# EAGLE design Remote (EAGLE 8.4.1)
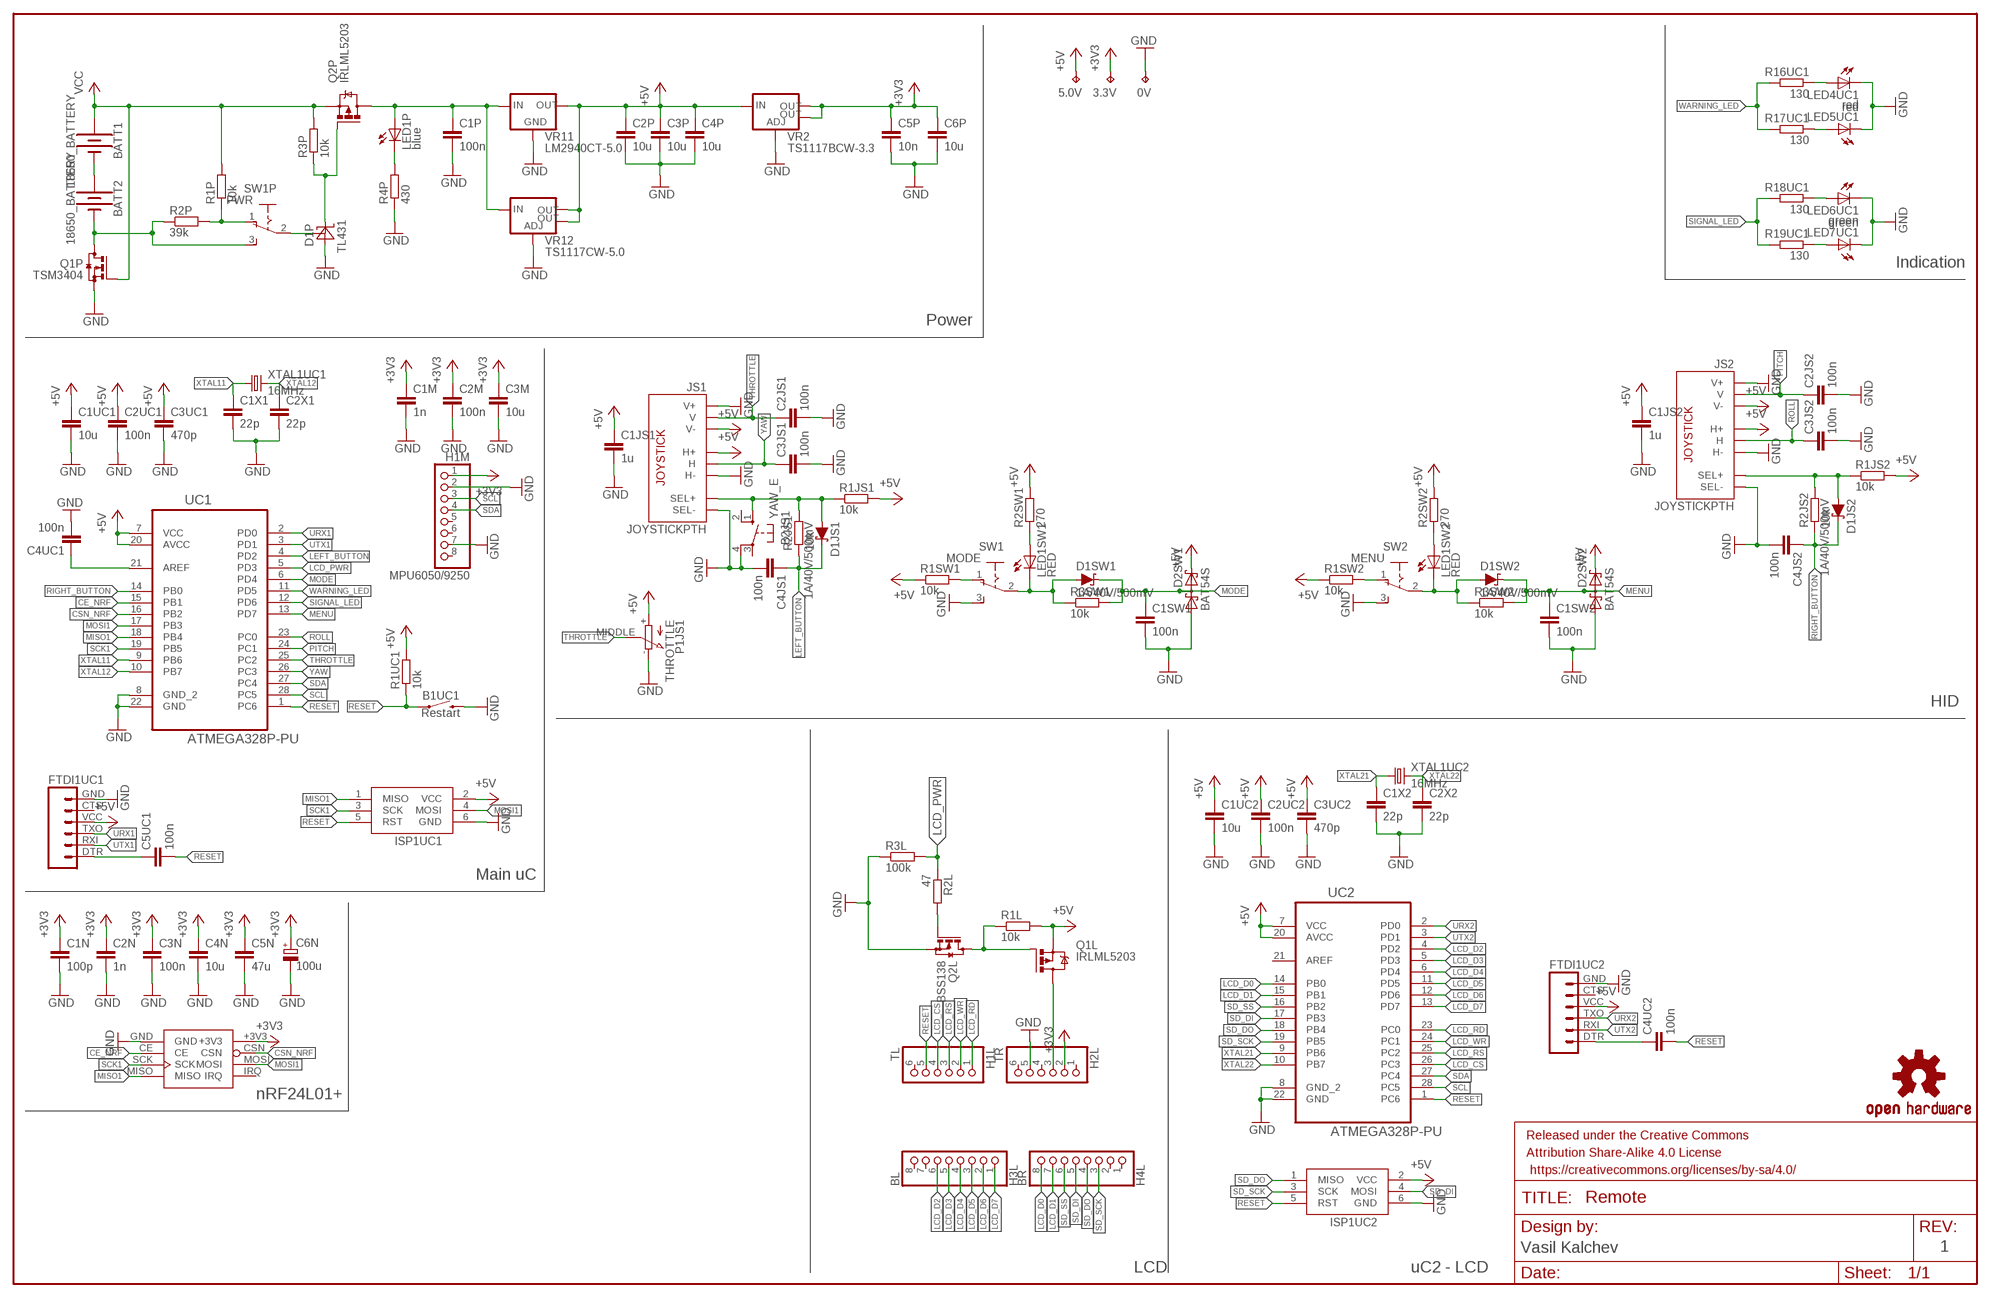
[diagram p0: schematic, sheet 1]

## Parts
0V  TPTP10SQ  [TP10SQ]
3.3V  TPTP10SQ  [TP10SQ]
5.0V  TPTP10SQ  [TP10SQ]
B1  nRF24L01+  NRF24L01+_PA_LNA_BREAKOUT  [NRF24L01+_PA_LNA]
B1UC1  Restart  MOMENTARY-SWITCH-SPST-SMD-6.0X3.5MM  [TACTILE_SWITCH_SMD_6.0X3.5MM]
B2JS1  YAW_E  40-XX  [B3F-40XX]
BATT1  18650_BATTERY  [BATTERY_HOLDER_18650]
BATT2  18650_BATTERY  [BATTERY_HOLDER_18650]
C1JS1  1u  C-EUC1206  [C1206]
C1JS2  1u  C-EUC1206  [C1206]
C1M  1n  C-EUC1206  [C1206]
C1N  100p  C-EUC1206  [C1206]
C1P  100n  C-EUC1206  [C1206]
C1SW1  100n  C-EUC1206  [C1206]
C1SW2  100n  C-EUC1206  [C1206]
C1UC1  10u  C-EUC1206  [C1206]
C1UC2  10u  C-EUC1206  [C1206]
C1X1  22p  C-EUC1206  [C1206]
C1X2  22p  C-EUC1206  [C1206]
C2JS1  100n  C-EUC1206  [C1206]
C2JS2  100n  C-EUC1206  [C1206]
C2M  100n  C-EUC1206  [C1206]
C2N  1n  C-EUC1206  [C1206]
C2P  10u  C-EUC1206  [C1206]
C2UC1  100n  C-EUC1206  [C1206]
C2UC2  100n  C-EUC1206  [C1206]
C2X1  22p  C-EUC1206  [C1206]
C2X2  22p  C-EUC1206  [C1206]
C3JS1  100n  C-EUC1206  [C1206]
C3JS2  100n  C-EUC1206  [C1206]
C3M  10u  C-EUC1206  [C1206]
C3N  100n  C-EUC1206  [C1206]
C3P  10u  C-EUC1206  [C1206]
C3UC1  470p  C-EUC1206  [C1206]
C3UC2  470p  C-EUC1206  [C1206]
C4JS1  100n  C-EUC1206  [C1206]
C4JS2  100n  C-EUC1206  [C1206]
C4N  10u  C-EUC1206  [C1206]
C4P  10u  C-EUC1206  [C1206]
C4UC1  100n  C-EUC1206  [C1206]
C4UC2  100n  C-EUC1206  [C1206]
C5N  47u  C-EUC3225  [C3225]
C5P  10n  C-EUC1206  [C1206]
C5UC1  100n  C-EUC1206  [C1206]
C6N  100u  CPOL-EU153CLV-0505  [153CLV-0505]
C6P  10u  C-EUC1206  [C1206]
D1JS1  1A/40V/500mV  DIODE-SCHOTTKY-SS14  [SMA-DIODE]
D1JS2  1A/40V/500mV  DIODE-SCHOTTKY-SS14  [SMA-DIODE]
D1P  TL431  TL431-SO8  [SO-8]
D1SW1  1A/40V/500mV  DIODE-SCHOTTKY-SS14  [SMA-DIODE]
D1SW2  1A/40V/500mV  DIODE-SCHOTTKY-SS14  [SMA-DIODE]
D2SW1  BAT54S  [SOT23]
D2SW2  BAT54S  [SOT23]
FRAME2  FRAME-LEDGER  [CREATIVE_COMMONS]
FTDI1UC1  FTDI_BASICPTH  [FTDI_BASIC]
FTDI1UC2  FTDI_BASICPTH  [FTDI_BASIC]
H1L  TL  PINHD-1X6_2.54  [1X06]
H1M  MPU6050/9250  PINHD-1X8_2.54  [1X08]
H2L  TR  PINHD-1X6_2.54  [1X06]
H3L  BL  PINHD-1X8_2.54  [1X08]
H4L  BR  PINHD-1X8_2.54  [1X08]
ISP1UC1  AVRISP-6  [AVRISP]
ISP1UC2  AVRISP-6  [AVRISP]
JS1  JOYSTICKPTH  [JOYSTICK]
JS2  JOYSTICKPTH  [JOYSTICK]
LED1P  blue  LEDSML1206  [SML1206]
LED1SW1  RED  LEDSML1206  [SML1206]
LED1SW2  RED  LEDSML1206  [SML1206]
LED4UC1  red  LEDSML1206  [SML1206]
LED5UC1  red  LEDSMT1206  [1206]
LED6UC1  green  LEDSML1206  [SML1206]
LED7UC1  green  LEDSMT1206  [1206]
LOGO1  OSHW-LOGOL-COPPER  [OSHW-LOGO-L_COPPER]
P1JS1  THROTTLE  SLIDE_POTENTIOMETER_EU  [SLIDE_POTENTIOMETER]
Q1L  IRLML5203  [MICRO3]
Q1P  TSM3404  BSS123  [SOT23]
Q2L  BSS138  BSS123  [SOT23]
Q2P  IRLML5203  [MICRO3]
R1JS1  10k  R-EU_R1206  [R1206]
R1JS2  10k  R-EU_R1206  [R1206]
R1L  10k  R-EU_R1206  [R1206]
R1P  10k  R-EU_R1206  [R1206]
R1SW1  10k  R-EU_R1206  [R1206]
R1SW2  10k  R-EU_R1206  [R1206]
R1UC1  10k  R-EU_R1206  [R1206]
R2JS1  10k  R-EU_R1206  [R1206]
R2JS2  10k  R-EU_R1206  [R1206]
R2L  47  R-EU_R1206  [R1206]
R2P  39k  R-EU_R1206  [R1206]
R2SW1  270  R-EU_R1206  [R1206]
R2SW2  270  R-EU_R1206  [R1206]
R3L  100k  R-EU_R1206  [R1206]
R3P  10k  R-EU_R1206  [R1206]
R3SW1  10k  R-EU_R1206  [R1206]
R3SW2  10k  R-EU_R1206  [R1206]
R4P  430  R-EU_R1206  [R1206]
R16UC1  130  R-EU_R1206  [R1206]
R17UC1  130  R-EU_R1206  [R1206]
R18UC1  130  R-EU_R1206  [R1206]
R19UC1  130  R-EU_R1206  [R1206]
SW1  MODE  SPDT_SWITCH_2MM  [SWITCH_2MM]
SW1P  PWR  SPDT_SWITCH_2MM  [SWITCH_2MM]
SW2  MENU  SPDT_SWITCH_2MM  [SWITCH_2MM]
UC1  ATMEGA328P-PU  [DIP254P762X457-28]
UC2  ATMEGA328P-PU  [DIP254P762X457-28]
VR2  TS1117BCW-3.3  V_REG_LM1117SOT223  [SOT223]
VR11  LM2940CT-5.0  78XXL  [78XXL]
VR12  TS1117CW-5.0  V_REG_LM1117SOT223  [SOT223]
XTAL1UC1  16MHz  CRYSTALHC49S  [HC49/S]
XTAL1UC2  16MHz  CRYSTALHC49S  [HC49/S]

## Nets
+3V3: 3.3V.TP B1.+3V3 C1M.1 C1N.1 C2M.1 C2N.1 C3M.1 C3N.1 C4N.1 C5N.1 C5P.1 C6N.+ C6P.1 H1M.1 H2L.2 VR2.2(OUT) VR2.4(OUT)
+5V: 5.0V.TP C1JS1.1 C1JS2.1 C1UC1.1 C1UC2.1 C2P.1 C2UC1.1 C2UC2.1 C3P.1 C3UC1.1 C3UC2.1 C4P.1 D2SW1.2(C2) D2SW2.2(C2) FTDI1UC1.VCC FTDI1UC2.VCC ISP1UC1.2(VCC) ISP1UC2.2(VCC) JS1.H1(H+) JS1.V3(V-) JS2.H1(H+) JS2.V3(V-) P1JS1.+ Q1L.2(S) R1JS1.2 R1JS2.2 R1L.2 R1SW1.1 R1SW2.1 R1UC1.2 R2SW1.2 R2SW2.2 UC1.7(VCC) UC1.20(AVCC) UC2.7(VCC) UC2.20(AVCC) VR2.3(IN) VR11.OUT VR12.2(OUT) VR12.4(OUT)
CE_NRF: B1.CE UC1.15(PB1)
CSN_NRF: B1.CSN UC1.16(PB2)
GND: 0V.TP B1.GND B1UC1.2 B2JS1.4(P1) C1JS1.2 C1JS2.2 C1M.2 C1N.2 C1P.2 C1SW1.2 C1SW2.2 C1UC1.2 C1UC2.2 C1X1.2 C1X2.2 C2JS1.2 C2JS2.2 C2M.2 C2N.2 C2P.2 C2UC1.2 C2UC2.2 C2X1.2 C2X2.2 C3JS1.2 C3JS2.2 C3M.2 C3N.2 C3P.2 C3UC1.2 C3UC2.2 C4JS1.2 C4JS2.2 C4N.2 C4P.2 C4UC1.2 C5N.2 C5P.2 C6N.- C6P.2 D1P.2(ANODE) D1P.3(ANODE) D1P.6(ANODE) D1P.7(ANODE) D2SW1.1(A1) D2SW2.1(A1) FTDI1UC1.GND FTDI1UC2.GND H1M.2 H1M.7 H2L.5 ISP1UC1.6(GND) ISP1UC2.6(GND) JS1.B2A(SEL-) JS1.H3(H-) JS1.V1(V+) JS2.B2A(SEL-) JS2.H3(H-) JS2.V1(V+) LED4UC1.C LED5UC1.C LED6UC1.C LED7UC1.C P1JS1.- Q1P.2(S) Q2L.2(S) R3L.1 R4P.1 SW1.3 SW2.3 UC1.8(GND_2) UC1.22(GND) UC2.8(GND_2) UC2.22(GND) VR2.1(ADJ) VR11.GND VR12.1(ADJ)
LCD_CS: H1L.4 UC2.26(PC3)
LCD_D0: H4L.8 UC2.14(PB0)
LCD_D1: H4L.7 UC2.15(PB1)
LCD_D2: H3L.6 UC2.4(PD2)
LCD_D3: H3L.5 UC2.5(PD3)
LCD_D4: H3L.4 UC2.6(PD4)
LCD_D5: H3L.3 UC2.11(PD5)
LCD_D6: H3L.2 UC2.12(PD6)
LCD_D7: H3L.1 UC2.13(PD7)
LCD_PWR: R2L.1 R3L.2 UC1.5(PD3)
LCD_RD: H1L.1 UC2.23(PC0)
LCD_RS: H1L.3 UC2.25(PC2)
LCD_WR: H1L.2 UC2.24(PC1)
LEFT_BUTTON: C4JS1.1 D1JS1.C R2JS1.1 UC1.4(PD2)
MENU: C1SW2.1 D1SW2.C D2SW2.3(C1A2) R3SW2.2 UC1.13(PD7)
MISO1: B1.MISO ISP1UC1.1(MISO) UC1.18(PB4)
MODE: C1SW1.1 D1SW1.C D2SW1.3(C1A2) R3SW1.2 UC1.6(PD4)
MOSI1: B1.MOSI ISP1UC1.4(MOSI) UC1.17(PB3)
N$3: C4UC1.1 UC1.21(AREF)
N$5: LED1SW1.A R2SW1.1
N$7: C5UC1.1 FTDI1UC1.DTR
N$8: BATT1.- BATT2.+
N$9: R1SW2.2 SW2.1
N$10: D1SW2.A LED1SW2.C R3SW2.1 SW2.2
N$11: LED1P.C R4P.2
N$12: D1SW1.A LED1SW1.C R3SW1.1 SW1.2
N$13: LED1SW2.A R2SW2.1
N$14: R1SW1.2 SW1.1
N$15: D1JS2.A JS2.B1A(SEL+) R1JS2.1 R2JS2.2
N$16: BATT2.- Q1P.3(D) R2P.1 SW1P.3
N$17: LED4UC1.A R16UC1.1
N$18: LED6UC1.A R18UC1.1
N$19: C4UC2.1 FTDI1UC2.DTR
N$20: LED5UC1.A R17UC1.1
N$21: H2L.3 Q1L.3(D)
N$22: LED7UC1.A R19UC1.1
N$23: C1P.1 LED1P.A Q2P.3(D) VR11.IN VR12.3(IN)
N$24: D1P.8(REFERENCE) SW1P.2
N$25: R1P.1 R2P.2 SW1P.1
N$26: Q1L.1(G) Q2L.3(D) R1L.1
N$31: D1P.1(CATHODE) Q2P.1(G) R3P.1
N$32: Q2L.1(G) R2L.2
PITCH: C2JS2.1 JS2.V2(V) UC1.24(PC1)
RESET: B1UC1.1 C4UC2.2 C5UC1.2 H1L.5 ISP1UC1.5(RST) ISP1UC2.5(RST) R1UC1.1 UC1.1(PC6) UC2.1(PC6)
RIGHT_BUTTON: C4JS2.1 D1JS2.C R2JS2.1 UC1.14(PB0)
ROLL: C3JS2.1 JS2.H2(H) UC1.23(PC0)
SCK1: B1.SCK ISP1UC1.3(SCK) UC1.19(PB5)
SCL: H1M.3 UC1.28(PC5) UC2.28(PC5)
SD_DI: H4L.5 ISP1UC2.4(MOSI) UC2.17(PB3)
SD_DO: H4L.4 ISP1UC2.1(MISO) UC2.18(PB4)
SD_SCK: H4L.3 ISP1UC2.3(SCK) UC2.19(PB5)
SD_SS: H4L.6 UC2.16(PB2)
SDA: H1M.4 UC1.27(PC4) UC2.27(PC4)
SIGNAL_LED: R18UC1.2 R19UC1.2 UC1.12(PD6)
SN1: B2JS1.1(S) D1JS1.A JS1.B1A(SEL+) R1JS1.1 R2JS1.2
THROTTLE: C2JS1.1 JS1.V2(V) P1JS1.MIDDLE UC1.25(PC2)
URX1: FTDI1UC1.TXO UC1.2(PD0)
URX2: FTDI1UC2.TXO UC2.2(PD0)
UTX1: FTDI1UC1.RXI UC1.3(PD1)
UTX2: FTDI1UC2.RXI UC2.3(PD1)
VCC: BATT1.+ Q1P.1(G) Q2P.2(S) R1P.2 R3P.2
WARNING_LED: R16UC1.2 R17UC1.2 UC1.11(PD5)
XTAL11: C1X1.1 UC1.9(PB6) XTAL1UC1.1
XTAL12: C2X1.1 UC1.10(PB7) XTAL1UC1.2
XTAL21: C1X2.1 UC2.9(PB6) XTAL1UC2.1
XTAL22: C2X2.1 UC2.10(PB7) XTAL1UC2.2
YAW: C3JS1.1 JS1.H2(H) UC1.26(PC3)
Unconnected: B1.IRQ B2JS1.2(S1) B2JS1.3(P) FTDI1UC1.CTS FTDI1UC2.CTS H1L.6 H1M.5 H1M.6 H1M.8 H2L.1 H2L.4 H2L.6 H3L.7 H3L.8 H4L.1 H4L.2 UC2.21(AREF)

## Notes on the sheet
- Indication
- Power
- HID
- Main uC
- nRF24L01+
- Vasil Kalchev | 1
- LCD | uC2 - LCD

## Library data of the parts
0V 3.3V 5.0V = testpad:TP: Test pad
B1 = VaSe7u - Breakouts:NRF24L01+_PA_LNA_BREAKOUT
B1UC1 = SparkFun-Switches:MOMENTARY-SWITCH-SPST: Momentary Switch (Pushbutton) - SPST Normally-open (NO) SPST momentary switches (buttons, pushbuttons). Variants PTH-12MM - 12mm square, through-hole Momentary Pushbutton Switch - 12mm Square <https://www.sparkfun.com/products/9190> (COM-09190) PTH-6.0MM, PTH-6.0MM-KIT - 6.0mm square, through-hole Mini Pushbutton Switch <https://www.sparkfun.com/products/97> (COM-00097) KIT package intended for soldering kit's - only one side of pads' copper is exposed. PTH-RIGHT-ANGLE-KIT - Right-angle, through-hole Right Angle Tactile Button <https://www.sparkfun.com/products/10791> - Used on SparkFun BigTime Watch Kit <https://www.sparkfun.com/products/11734> SMD-12MM - 12mm square, surface-mount Tactile Button - SMD (12mm) <https://www.sparkfun.com/products/12993> (COM-12993) Used on SparkFun PicoBoard <https://www.sparkfun.com/products/11888> SMD-4.5MM - 4.5mm Square Trackball Switch Used on SparkFun Blackberry Trackballer Breakout <https://www.sparkfun.com/products/13169> SMD-4.6MMX2.8MM - 4.60mm x 2.80mm, surface mount Used on SparkFun SAMD21 Mini Breakout <https://www.sparkfun.com/products/13664> SMD-5.2MM, SMD-5.2-REDUNDANT - 5.2mm square, surface-mount Mini Pushbutton Switch - SMD <https://www.sparkfun.com/products/8720> (COM-08720) Used on Arduino Pro Mini <https://www.sparkfun.com/products/11114> REDUNDANT package connects both switch circuits together SMD-6.0X3.5MM - 6.0 x 3.5mm, surface mount Momentary Reset Switch SMD <https://www.sparkfun.com/products/8229> (COM-08229) SMD-6.2MM-TALL - 6.2mm square, surface mount Tactile Button - SMD (6mm) <https://www.sparkfun.com/products/12992> Used on SparkFun Digital Sandbox <https://www.sparkfun.com/products/12651> SMD-RIGHT-ANGLE - Right-angle, surface mount Used on SparkFun Block for Intel® Edison - Arduino <https://www.sparkfun.com/products/13036>; PROD_ID: SWCH-00815; SF_SKU: COM-08229
B2JS1 = switch-omron:40-XX: OMRON SWITCH; MF: OMRON COMPONENTS USA; MPN: B3F-4000; OC_FARNELL: 176434; OC_NEWARK: 36K3105
BATT1 BATT2 = VaSe7u - Battery holders:18650_BATTERY
C1JS1 C1JS2 C1M C1N C1P C1UC1 C1UC2 C1X1 C1X2 C2M C2N C2P C2UC1 C2UC2 C2X1 C2X2 C3M C3N C3P C3UC1 C3UC2 C4N C4P C4UC1 C4UC2 C5N C5P C5UC1 C6P = rcl:C-EU: CAPACITOR, European symbol
C1SW1 C1SW2 C2JS1 C2JS2 C3JS1 C3JS2 C4JS1 C4JS2 = resistor:C-EU: CAPACITOR, European symbol
C6N = rcl:CPOL-EU: POLARIZED CAPACITOR, European symbol
D1JS1 D1JS2 D1SW1 D1SW2 = SparkFun-DiscreteSemi:DIODE-SCHOTTKY: Schottky diode A Schottky diode is a semiconductor diode which has a low forward voltage drop and a very fast switching action.; PROD_ID: DIO-08053
D1P = Diodes:TL431-SO8; PRICE: 0.3BGN
D2SW1 = diode:BAT54S: Schottky Diodes Pin connection corrected 2011-05-04 Source: Fairchild .. BAT54.pdf; PRICE: 0.06BGN
D2SW2 = diode:BAT54S: Schottky Diodes Pin connection corrected 2011-05-04 Source: Fairchild .. BAT54.pdf
FRAME2 = SparkFun-Aesthetics:FRAME-LEDGER: Schematic Frame - Ledger Standard 11x14 US Ledger frame
FTDI1UC1 FTDI1UC2 = SparkFun-Connectors:FTDI_BASIC: FTDI Basic header with labels
H1L H2L = pinhead-1:PINHD-1X6: PIN HEADER
H1M H3L H4L = pinhead-1:PINHD-1X8: PIN HEADER
ISP1UC1 ISP1UC2 = adafruit:AVRISP: AVR ISP HEADER Standard 6 pin header for AVR programming
JS1 JS2 = adafruit:JOYSTICK: Thumb Joystick Joystick commonly found in PS2 controllers. Two pots and a select switch. Adapted from Sparkfun Library (but for more common 6mm switch sticks)
LED1P LED1SW1 LED1SW2 LED4UC1 LED5UC1 LED6UC1 LED7UC1 = led:LED: LED OSRAM: - CHIPLED LG R971, LG N971, LY N971, LG Q971, LY Q971, LO R971, LY R971 LH N974, LH R974 LS Q976, LO Q976, LY Q976 LO Q996 - Hyper CHIPLED LW Q18S LB Q993, LB Q99A, LB R99A - SideLED LS A670, LO A670, LY A670, LG A670, LP A670 LB A673, LV A673, LT A673, LW A673 LH A674 LY A675 LS A676, LA A676, LO A676, LY A676, LW A676 LS A679, LY A679, LG A679 - Hyper Micro SIDELED® LS Y876, LA Y876, LO Y876, LY Y876 LT Y87S - SmartLED LW L88C, LW L88S LB L89C, LB L89S, LG L890 LS L89K, LO L89K, LY L89K LS L896, LA L896, LO L896, LY L896 - TOPLED LS T670, LO T670, LY T670, LG T670, LP T670 LSG T670, LSP T670, LSY T670, LOP T670, LYG T670 LG T671, LOG T671, LSG T671 LB T673, LV T673, LT T673, LW T673 LH T674 LS T676, LA T676, LO T676, LY T676, LB T676, LH T676, LSB T676, LW T676 LB T67C, LV T67C, LT T67C, LS T67K, LO T67K, LY T67K, LW E67C LS E67B, LA E67B, LO E67B, LY E67B, LB E67C, LV E67C, LT E67C LW T67C LS T679, LY T679, LG T679 LS T770, LO T770, LY T770, LG T770, LP T770 LB T773, LV T773, LT T773, LW T773 LH T774 LS E675, LA E675, LY E675, LS T675 LS T776, LA T776, LO T776, LY T776, LB T776 LHGB T686 LT T68C, LB T68C - Hyper Mini TOPLED® LB M676 - Mini TOPLED Santana® LG M470 LS M47K, LO M47K, LY M47K Source: http://www.osram.convergy.de LUXEON: - LUMILED® LXK2-PW12-R00, LXK2-PW12-S00, LXK2-PW14-U00, LXK2-PW14-V00 LXK2-PM12-R00, LXK2-PM12-S00, LXK2-PM14-U00 LXK2-PE12-Q00, LXK2-PE12-R00, LXK2-PE12-S00, LXK2-PE14-T00, LXK2-PE14-U00 LXK2-PB12-K00, LXK2-PB12-L00, LXK2-PB12-M00, LXK2-PB14-N00, LXK2-PB14-P00, LXK2-PB14-Q00 LXK2-PR12-L00, LXK2-PR12-M00, LXK2-PR14-Q00, LXK2-PR14-R00 LXK2-PD12-Q00, LXK2-PD12-R00, LXK2-PD12-S00 LXK2-PH12-R00, LXK2-PH12-S00 LXK2-PL12-P00, LXK2-PL12-Q00, LXK2-PL12-R00 Source: www.luxeon.com KINGBRIGHT: KA-3528ASYC Source: www.kingbright.com
LOGO1 = SparkFun-Aesthetics:OSHW-LOGO: Open-Source Hardware (OSHW) Logo This logo indicates the piece of hardware it is found on incorporates a OSHW license and/or adheres to the definition of open source hardware found here: http://freedomdefined.org/OSHW
P1JS1 = VaSe7u - Linear:SLIDE_POTENTIOMETER_EU
Q1L Q2P = transistor-power:IRLML5203: HEXFET P-Channel Power MOSFET; PRICE: 0.22BGN
Q1P = transistor-small-signal:BSS123: N-CHANNEL MOS FET
Q2L = transistor-small-signal:BSS123: N-CHANNEL MOS FET; PRICE: 0.11BGN
R1JS1 R1JS2 R1L R1P R1SW1 R1SW2 R1UC1 R2JS1 R2JS2 R2L R2P R2SW1 R2SW2 R3L R3P R3SW1 R3SW2 R4P R16UC1 R17UC1 R18UC1 R19UC1 = rcl:R-EU_: RESISTOR, European symbol
SW1 SW1P SW2 = Switches:SPDT_SWITCH_2MM: SPDT switch, 2mm pitch with mounting holes.
UC1 UC2 = Atmel_By_element14_Batch_1-00:ATMEGA328P-PU: 8-bit Microcontroller with In-System Programmable Flash; MPN: ATMEGA328P-PU; OC_FARNELL: 1715487; OC_NEWARK: 15R0268; PACKAGE: PDIP-28; SUPPLIER: Atmel
VR2 = SparkFun-IC-Power:V_REG_LM1117: Voltage Regulator LM1117 Standard adjustable voltage regulator but in SMD form. Spark Fun Electronics SKU : COM-00595; PRICE: 0.85BGN; PROD_ID: VREG-08170
VR11 = v-reg:78XXL: VOLTAGE REGULATOR; PRICE: 2.30BGN
VR12 = SparkFun-IC-Power:V_REG_LM1117: Voltage Regulator LM1117 Standard adjustable voltage regulator but in SMD form. Spark Fun Electronics SKU : COM-00595; PRICE: 0.45BGN; PROD_ID: VREG-08170
XTAL1UC1 XTAL1UC2 = crystal:CRYSTAL: CRYSTAL; OC_FARNELL: 1667008; OC_NEWARK: unknown

## Board
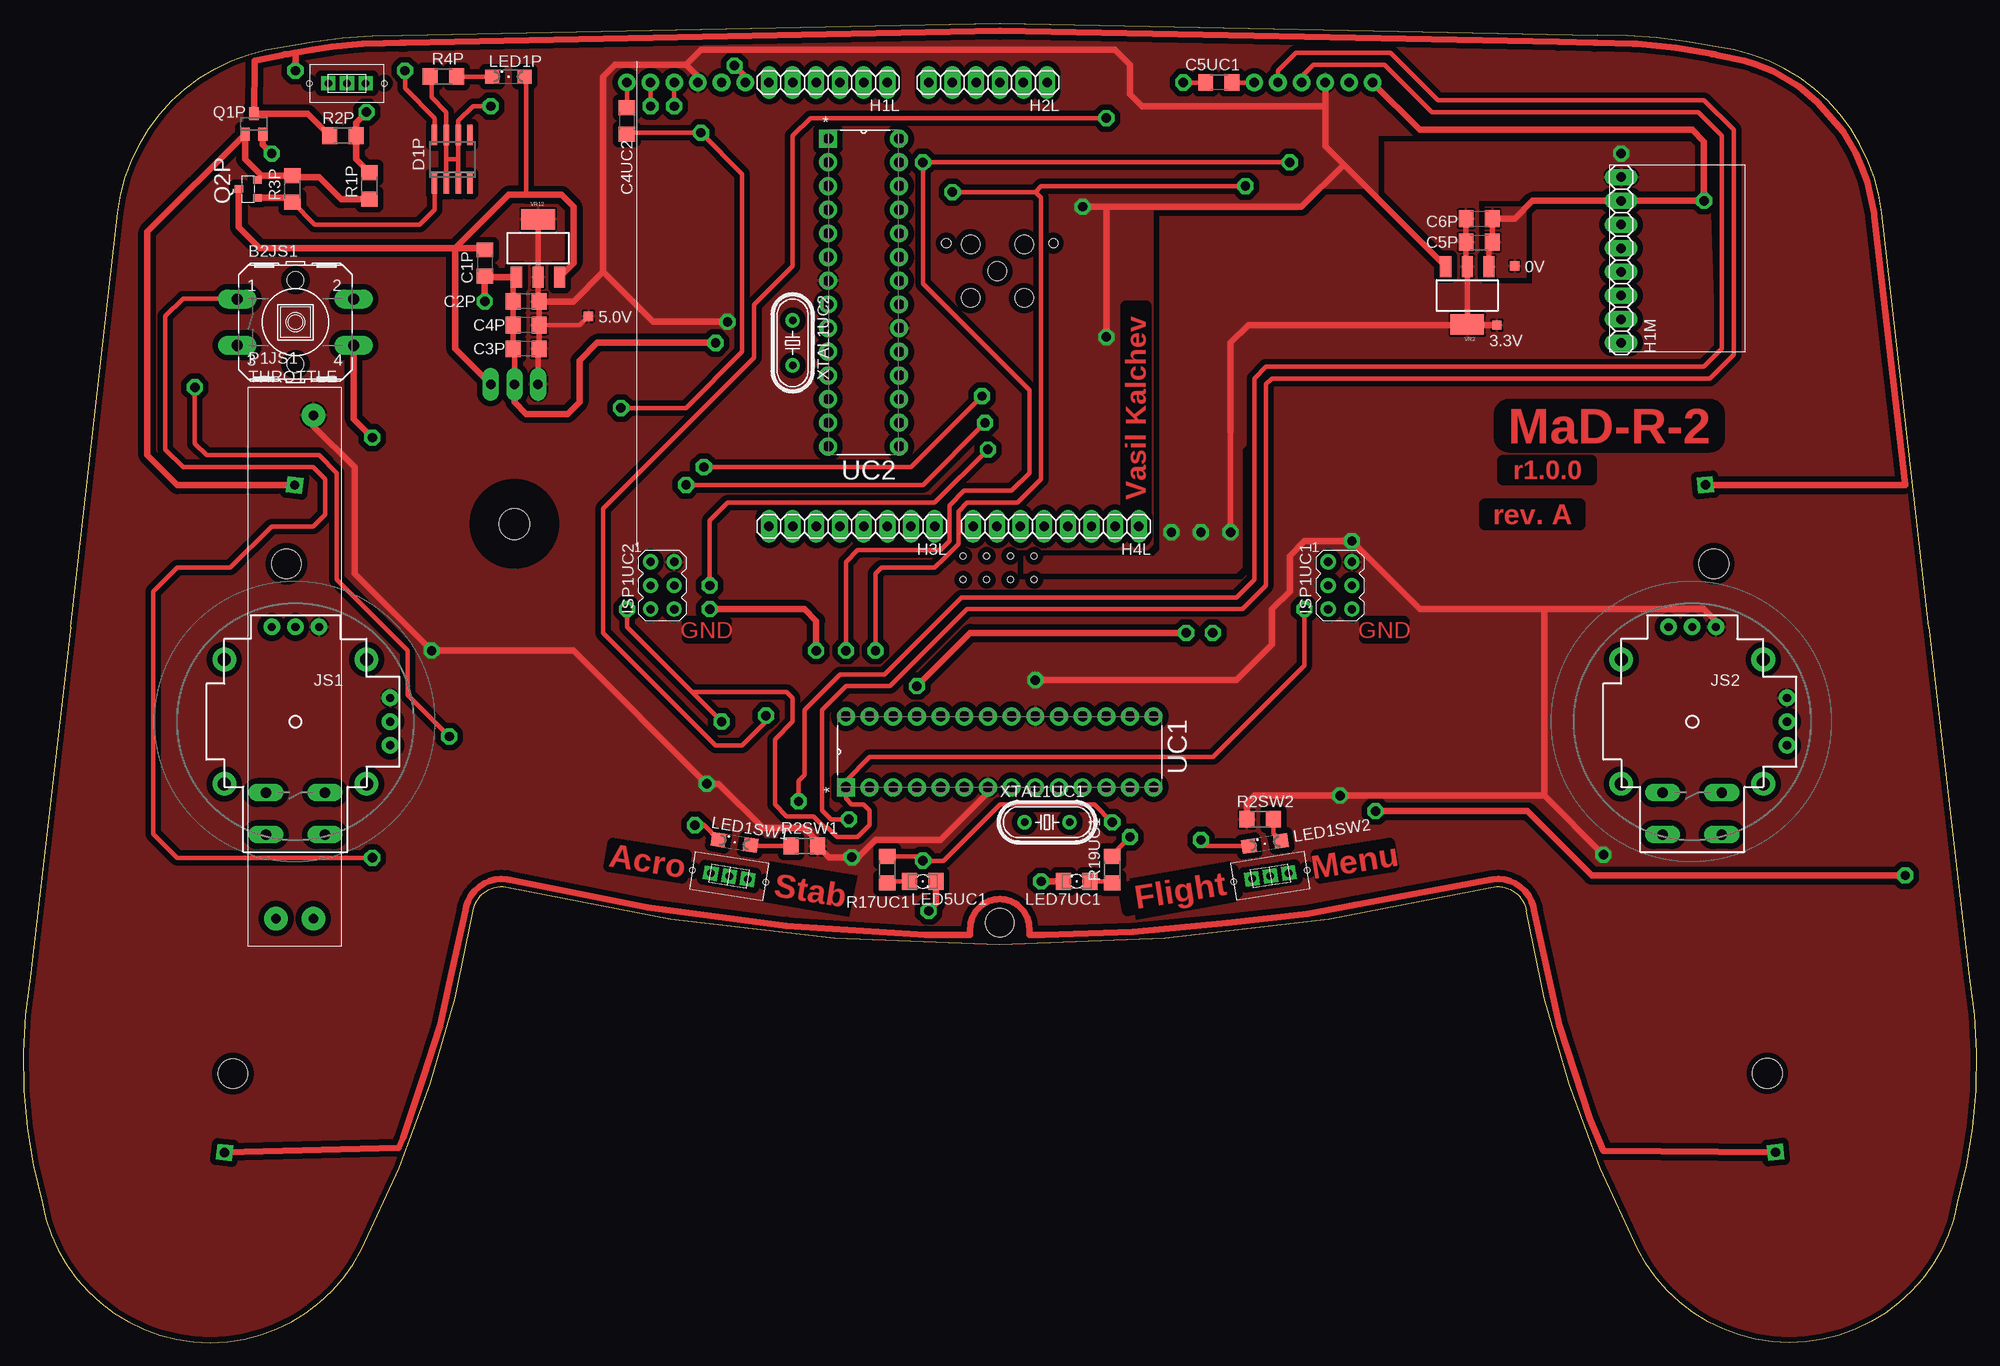
[diagram p1: board, top side]
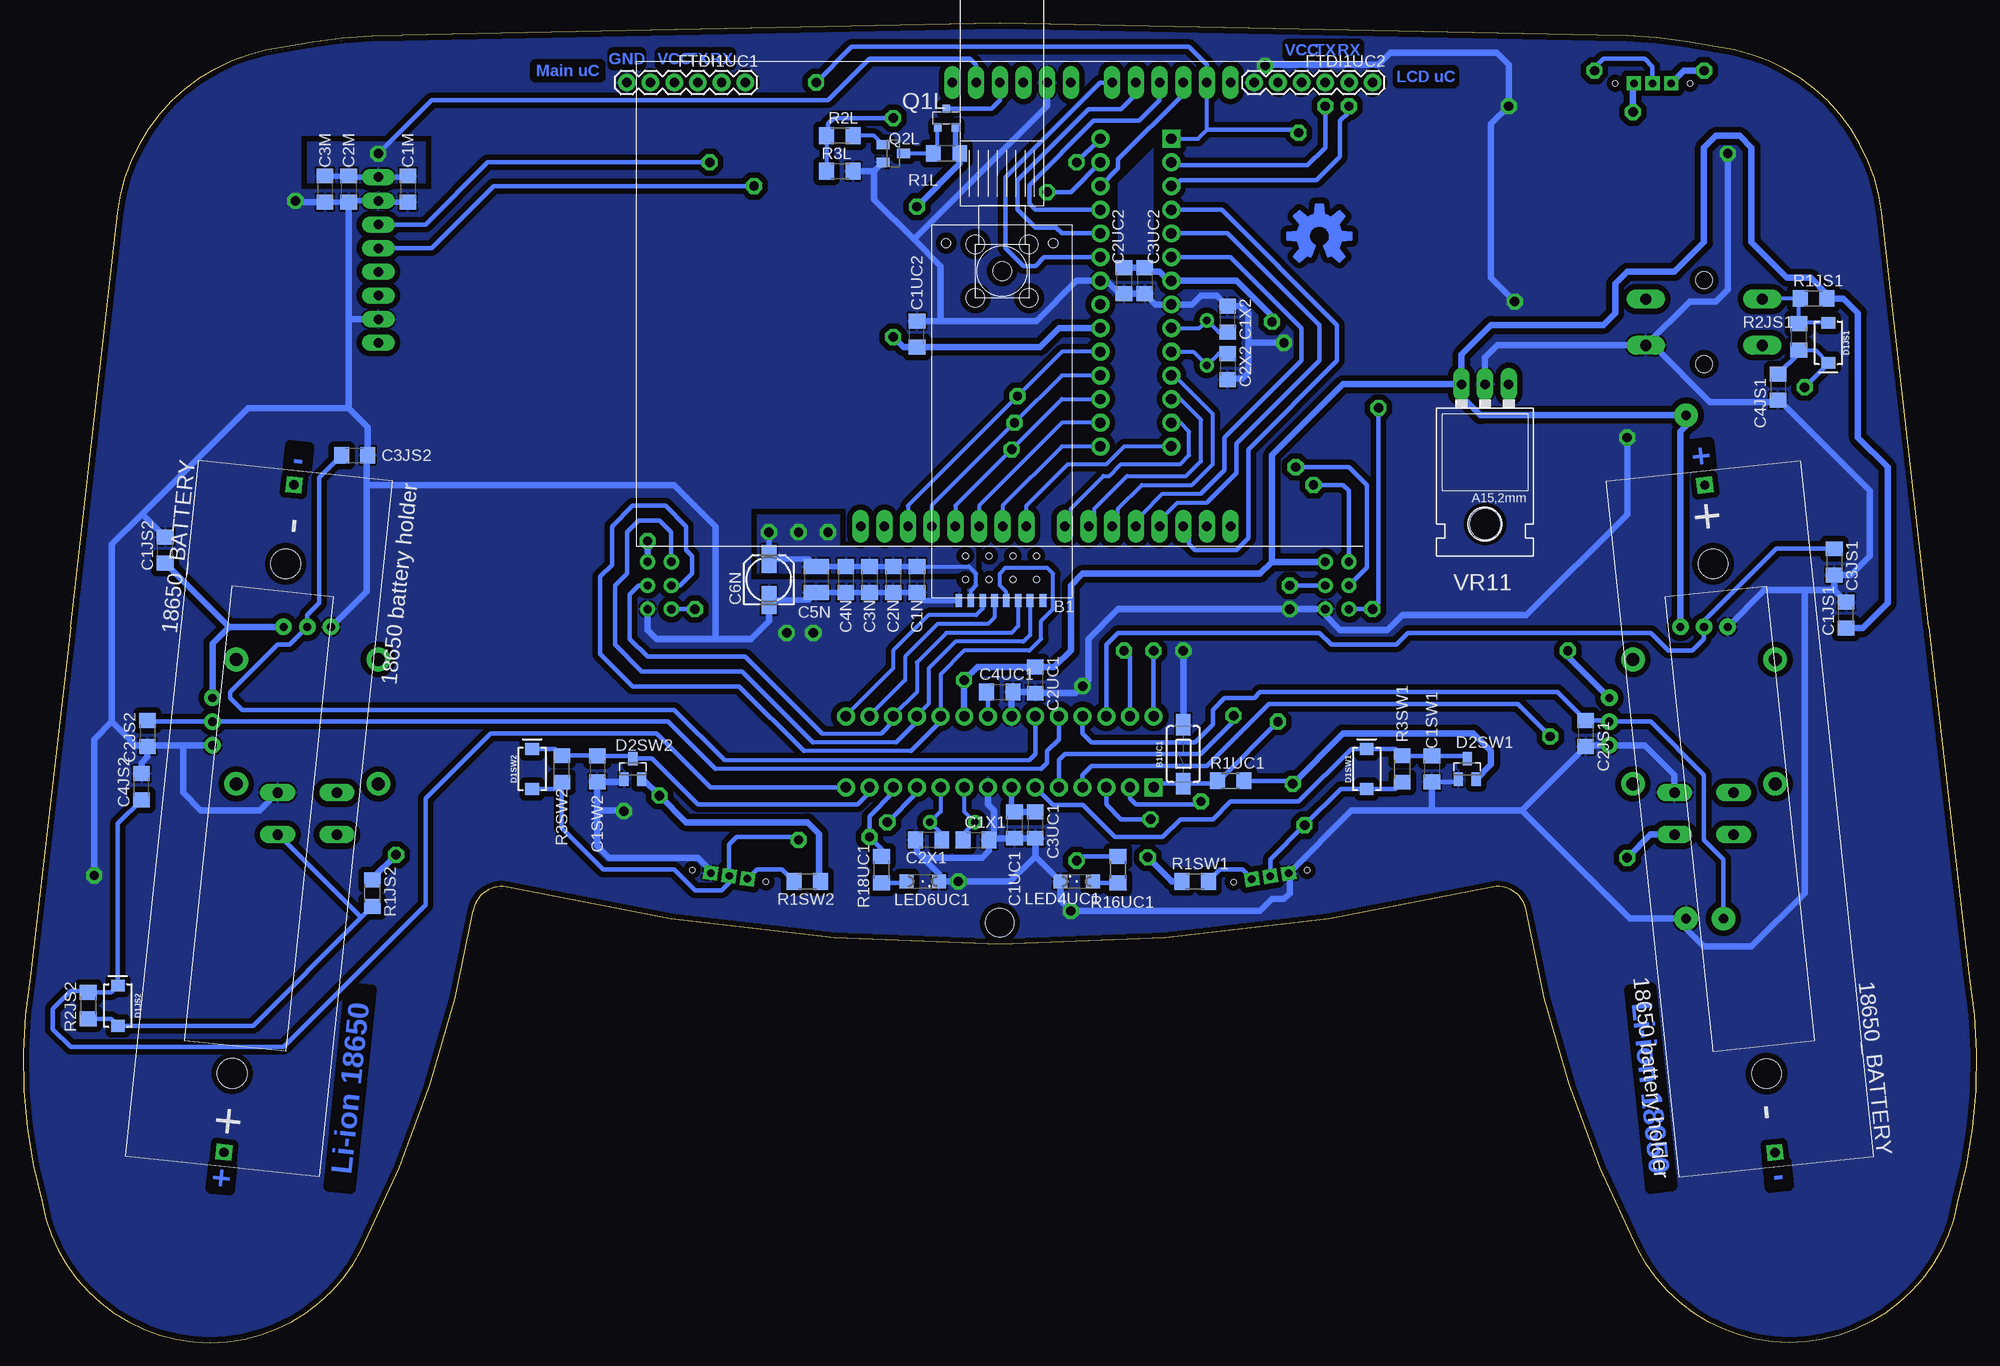
[diagram p2: board, bottom side, seen from below]

Size 209.52 x 141.56 mm. Coordinates in mm from the lower left corner, seen from the top.
Outline: 5.07,76.79 0.75,39.19 arc25 2.02,15.06 arc143 36.31,9.98 arc18 48.25,46.31 arc-94 52.06,48.85 arc26 157.47,48.85 arc-94 161.28,46.31 arc18 173.21,9.98 arc143 207.5,15.06 arc25 208.77,39.19 204.46,76.79 199.38,121.24 arc77 181.6,139.02 arc13 168.9,140.29 104.76,141.56 40.63,140.29 arc13 27.93,139.02 arc77 10.15,121.24 5.07,76.79
Copper layers (1*16): Top 0.035mm / dielectric 1mm / Bottom 0.035mm
Design rules "VaSe7u - Photo method *": minimum track width 16mil, minimum drill 0.8mm, track to track 18mil, track to pad 18mil, pad to pad 18mil, via to via 18mil, smd to smd 10mil, copper to edge 18mil, drill to drill 14mil, minimum pad ring 14mil, minimum via ring 14mil, stop-mask expansion 4mil, vias tented up to drill 0mil, thermal gap 8mil
Holes 3.05 mm at 104.76,45.04
tKeepout: area 16.5,53.9 to 41.9,79.3; area 166.4,53.9 to 191.8,79.3; area 24.1,42.5 to 34.3,102.5
bKeepout: area 11.1,17.7 to 39.7,94.6; area 169.8,17.7 to 198.4,94.6

### Footprints (pad centres in the part's own frame; a part is rotated, then mirrored left to right if it is on the bottom)
TP10SQ = smd 1 x 1: TP 0,0
NRF24L01+_PA_LNA = smd 1.422 x 0.711: +3V3 -0.334,10.857; CE -0.334,9.585; CSN -0.334,8.313; GND -0.334,12.13; IRQ -0.334,3.111; MISO -0.334,4.497; MOSI -0.334,5.769; SCK -0.334,7.042 | hole 0.65: 1.905,11.43; 4.445,11.43; 4.445,8.89; 1.905,8.89; 1.905,6.35; 4.445,6.35; 4.445,3.81; 1.905,3.81 | hole 2: 35,7.5; 37.873,4.627; 37.873,10.373; 32.127,10.373; 32.127,4.627 | hole 1: 38,2; 38,13.5
TACTILE_SWITCH_SMD_6.0X3.5MM = smd 2.3 x 1.6: 1 -3.15,0; 2 3.15,0
B3F-40XX = drill 1.194 long: 1 -6.248,2.489; 2 6.248,2.489; 3 -6.248,-2.489; 4 6.248,-2.489 | hole 1.803: 0,-4.496; 0,4.496
BATTERY_HOLDER_18650 = drill 1 square: + 36,0; - -36,0 | hole 3.2: -27.5,0; 27.5,0
C1206 = smd 1.6 x 1.8: 1 -1.4,0; 2 1.4,0
C3225 = smd 1.6 x 2.7: 1 -1.4,0; 2 1.4,0
153CLV-0505 = smd 3 x 1.6: + 2.2,0; - -2.2,0
SMA-DIODE = smd 1.27 x 1.47: A -2.15,0; C 2.15,0
SO-8 = smd 0.6 x 2.2: 1 -1.905,-2.6; 2 -0.635,-2.6; 3 0.635,-2.6; 4 1.905,-2.6; 5 1.905,2.6; 6 0.635,2.6; 7 -0.635,2.6; 8 -1.905,2.6
SOT23 = smd 1 x 1.4: 1 -0.95,-1.1; 2 0.95,-1.1; 3 0,1.1
FTDI_BASIC = drill 1.016 pad 1.88: CTS 10.16,0; DTR 0,0; GND 12.7,0; RXI 2.54,0; TXO 5.08,0; VCC 7.62,0
1X06 = drill 1.016 long: 1 -6.35,0; 2 -3.81,0; 3 -1.27,0; 4 1.27,0; 5 3.81,0; 6 6.35,0
1X08 = drill 1.016 long: 1 -8.89,0; 2 -6.35,0; 3 -3.81,0; 4 -1.27,0; 5 1.27,0; 6 3.81,0; 7 6.35,0; 8 8.89,0
AVRISP = drill 0.9 pad 1.626: 1 -1.27,2.54; 2 1.27,2.54; 3 -1.27,0; 4 1.27,0; 5 -1.27,-2.54; 6 1.27,-2.54
JOYSTICK = drill 1.1 pad 1.778 long: B1A -3.175,12.12; B1B 3.175,12.12; B2A -3.175,7.62; B2B 3.175,7.62 | drill 0.889 pad 1.778: H1 -2.54,-10.16; H2 0,-10.16; H3 2.54,-10.16; V1 -10.16,2.54; V2 -10.16,0; V3 -10.16,-2.54 | drill 1.397 pad 2.54: MOUNT1 -7.62,6.668; MOUNT2 -7.62,-6.668; MOUNT3 7.62,-6.668; MOUNT4 7.62,6.668
SML1206 = smd 1.5 x 1.5: A 1.75,0; C -1.75,0
1206 = smd 1.6 x 1.803: A -1.422,0; C 1.422,0
SLIDE_POTENTIOMETER = drill 1 pad 2.54: + 7,57; - 7,3; MIDDLE 3,3
MICRO3 = smd 0.8 x 0.9: 1 -0.95,-1; 2 0.95,-1; 3 0,1
R1206 = smd 1.6 x 1.803: 1 -1.422,0; 2 1.422,0
SWITCH_2MM = drill 0.8 square: 1 2,2; 2 4,2; 3 6,2 | hole 0.6: 0,2; 8,2
DIP254P762X457-28 = drill 1.118 square: 1 -7.62,33.02 | drill 1.118: 2 -7.62,30.48; 3 -7.62,27.94; 4 -7.62,25.4; 5 -7.62,22.86; 6 -7.62,20.32; 7 -7.62,17.78; 8 -7.62,15.24; 9 -7.62,12.7; 10 -7.62,10.16; 11 -7.62,7.62; 12 -7.62,5.08; 13 -7.62,2.54; 14 -7.62,0; 15 0,0; 16 0,2.54; 17 0,5.08; 18 0,7.62; 19 0,10.16; 20 0,12.7; 21 0,15.24; 22 0,17.78; 23 0,20.32; 24 0,22.86; 25 0,25.4; 26 0,27.94; 27 0,30.48; 28 0,33.02
SOT223 = smd 1.219 x 2.235: 1 -2.311,-3.099; 2 0,-3.099; 3 2.311,-3.099 | smd 3.6 x 2.2: 4 0,3.099
78XXL = drill 1.016 long: GND 0,-3.81; IN -2.54,-3.81; OUT 2.54,-3.81 | hole 3.302: 0,11.176
HC49/S = drill 0.813: 1 -2.413,0; 2 2.413,0

### Placement (x,y rotation side)
0V  160.01,115.52 0 top
3.3V  158.1,109.17 0 top
5.0V  60.63,110.12 0 top
B1  97.01,79.96 90 bottom
B1UC1  85.08,63.13 90 bottom
B2JS1  29.2,109.49 0 top
BATT1  25.36,56.2 96 bottom
BATT2  184.24,56.22 264 bottom
C1JS1  13.96,78.06 90 bottom
C1JS2  194.3,85.04 90 bottom
C1M  168.26,123.78 270 bottom
C1N  113.65,81.87 270 bottom
C1P  49.52,115.84 270 top
C1SW1  58.41,61.55 270 bottom
C1SW2  147.94,61.55 270 bottom
C1UC1  103.17,55.51 270 bottom
C1UC2  113.65,108.22 90 bottom
C1X1  107.3,53.93 0 bottom
C1X2  80.31,109.81 90 bottom
C2JS1  41.9,65.36 270 bottom
C2JS2  196.2,65.36 270 bottom
C2M  174.61,123.78 270 bottom
C2N  116.19,81.87 270 bottom
C2P  53.96,111.71 180 top
C2UC1  100.95,71.07 270 bottom
C2UC2  91.43,113.93 270 bottom
C2X1  112.38,53.93 180 bottom
C2X2  80.31,104.73 270 bottom
C3JS1  15.23,83.77 270 bottom
C3JS2  173.98,95.2 0 bottom
C3M  177.15,123.78 270 bottom
C3N  118.73,81.87 270 bottom
C3P  53.96,106.63 180 top
C3UC1  100.95,55.51 270 bottom
C3UC2  89.2,113.93 270 bottom
C4JS1  21.26,102.5 270 bottom
C4JS2  196.84,59.64 90 bottom
C4N  121.27,81.87 270 bottom
C4P  53.96,109.17 180 top
C4UC1  104.76,69.8 0 bottom
C4UC2  64.76,131.08 270 top
C5N  124.45,81.87 270 bottom
C5P  156.2,118.06 0 top
C5UC1  128.26,135.21 180 top
C6N  129.53,81.87 90 bottom
C6P  156.2,120.6 0 top
D1JS1  15.86,107.27 270 bottom
D1JS2  199.38,36.15 90 bottom
D1P  46.02,126.95 0 top
D1SW1  65.39,61.55 90 bottom
D1SW2  154.93,61.55 90 bottom
D2SW1  54.6,61.55 0 bottom
D2SW2  144.13,61.55 0 bottom
FRAME2  80.63,-33.07 0 top  (outside the outline)
FTDI1UC1  132.07,135.21 180 bottom
FTDI1UC2  64.76,135.21 180 bottom
H1L  86.35,135.21 180 top
H1M  171.44,116.16 270 top
H2L  103.49,135.21 180 top
H3L  88.89,87.58 180 top
H4L  110.79,87.58 180 top
ISP1UC1  141.27,81.23 0 top
ISP1UC2  68.57,81.23 0 top
JS1  29.2,66.63 180 top
JS2  179.06,66.63 180 top
LED1P  52.06,135.84 0 top
LED1SW1  76.31,53.67 351 top
LED1SW2  133.21,53.54 9 top
LED4UC1  96.51,49.48 0 bottom
LED5UC1  96.51,49.48 0 top
LED6UC1  113.02,49.48 180 bottom
LED7UC1  113.02,49.48 180 top
LOGO1  70.47,118.7 0 bottom
P1JS1  24.12,42.5 0 top
Q1L  110.48,131.4 0 bottom
Q1P  24.75,130.76 0 top
Q2L  116.19,127.59 270 bottom
Q2P  24.12,123.78 90 top
R1JS1  17.45,112.03 0 bottom
R1JS2  172.07,48.21 90 bottom
R1L  110.48,127.59 0 bottom
R1P  37.13,124.09 270 top
R1SW1  83.81,49.48 0 bottom
R1SW2  125.4,49.48 180 bottom
R1UC1  80,60.28 0 bottom
R2JS1  19.04,107.9 90 bottom
R2JS2  202.55,36.15 270 bottom
R2L  121.91,129.49 0 bottom
R2P  34.28,129.49 0 top
R2SW1  83.81,53.29 0 top
R2SW2  132.7,56.15 180 top
R3L  121.91,125.68 180 bottom
R3P  28.88,123.78 90 top
R3SW1  61.58,61.55 90 bottom
R3SW2  151.75,61.55 90 bottom
R4P  45.07,135.84 0 top
R16UC1  92.06,50.75 90 bottom
R17UC1  92.7,50.75 90 top
R18UC1  117.46,50.75 90 bottom
R19UC1  116.83,50.75 90 top
SW1  80,51.39 171 top
SW1P  38.72,137.11 180 top
SW2  130.16,47.47 9 top
UC1  121.27,67.2 90 top
UC2  93.97,96.15 0 top
VR2  154.93,112.35 180 top
VR11  52.69,99.01 180 bottom
VR12  55.23,117.43 0 top
XTAL1UC1  109.84,55.83 0 top
XTAL1UC2  82.54,107.27 270 top

### Tracks (layer width: path | path; a pad name or v marks a point on that pad's centre or on a via)
+3V3  (via drill 1)
  Top 0.61: C6P.1 C5P.1 154.8,115.57 VR2.2 VR2.4 | 129.53,97.74 v129.53,86.95
  Top 0.711: 3.3V.TP 155,109.17 VR2.4 154.85,109.17 131.43,109.17 129.53,107.27 129.53,97.74
  Bottom 0.406: C1N.1 108.07,83.27 107.3,82.5 107.3,81.23 107.87,80.66 B1.+3V3
  Bottom 0.457: H2L.2 107.3,137.11 107.94,137.75 118.73,137.75 123.18,133.3 165.72,133.3 v171.44,127.59
  Bottom 0.61: v129.53,86.95 C6N.+ 125.25,84.07 C5N.1 C4N.1 C3N.1 C2N.1 C1N.1 | C3M.1 C2M.1 174.48,125.05 H1M.1 168.39,125.05 C1M.1
  other vias: 123.18,86.95 126.35,86.95
  pour Bottom: 166.36,124.41 179.06,124.41 179.06,128.86 166.36,128.86
  pour Top (isolate 0.61, rank 2): 181.6,105.36 133.34,105.36 133.34,98.38 130.8,95.84 130.8,83.14 130.16,82.5 107.3,82.5 107.3,84.41 121.27,84.41 121.91,85.04 121.91,122.51 122.54,123.14 146.04,123.14 146.04,128.86 180.96,128.86 180.96,124.41
  pour Bottom (isolate 0.61): 130.8,82.5 109.21,82.5 108.25,81.55 108.25,79.33 107.62,79.33 107.62,80.6 107.3,80.91 107.3,85.36 121.91,85.36 121.91,88.85 130.8,88.85
+5V  (via drill 1)
  Top 0.457: C4P.1 59.68,109.17 5.0V.TP
  Top 0.61: VR12.4 VR12.2 55.23,111.84 C2P.1 C4P.1 C3P.1 55.23,106.5 VR11.OUT
  Top 0.711: FTDI1UC2.VCC 72.38,135.84 71.11,137.11 | 71.11,137.11 63.49,137.11 62.22,135.84 62.22,114.89 | 139.69,132.67 139.69,128.37 141.67,126.39 | 141.67,126.39 VR2.3 | 62.22,114.89 59.04,111.71 C2P.1 | R2SW2.2 131.28,57.9 132.07,58.69 v141.27,58.69 163.18,58.69 | 163.18,58.69 v169.53,52.34 | P1JS1.+ 31.12,98.36 35.55,93.93 35.55,82.5 v43.8,74.25 59.04,74.25 v73.33,59.96 74.6,59.96 79.36,55.2 83.81,55.2 85.23,53.77 R2SW1.2 86.46,52.06 v88.89,52.06 88.93,52.02 89.52,52.02 91.43,53.93 98.41,53.93 103.49,59.01 UC1.7 | 71.11,137.11 72.69,138.7 117.14,138.7 118.73,137.11 118.73,133.94 120,132.67 139.69,132.67 | 116.19,121.87 v113.65,121.87 | 116.19,121.87 137.15,121.87 141.67,126.39 | v116.19,107.9 116.19,121.87 | v108.57,71.07 130.16,71.07 133.97,74.88 133.97,78.69 135.88,80.6 135.88,84.41 137.46,85.99 v142.54,85.99 149.85,78.69 163.18,78.69 | v75.55,109.52 67.58,109.52 62.22,114.89 | JS2.H1 181.6,77.42 180.33,78.69 163.18,78.69 | 163.18,58.69 163.18,78.69 | 139.69,132.67 FTDI1UC1.VCC
  Bottom 0.406: 109.53,128.06 R1L.2
  Bottom 0.457: R1UC1.2 73.65,60.28 v73.33,59.96
  Bottom 0.61: 109.53,128.06 Q1L.2 | UC1.7 103.49,57.23 C1UC1.1
  Bottom 0.711: UC2.20 98.41,108.85 100.45,106.82 C1UC2.1 115.11,106.82 v116.19,107.9 | UC1.20 v108.57,71.07 107.17,72.47 C2UC1.1 98.92,72.47 97.14,74.25 97.14,81.23 95.87,82.5 76.82,82.5 75.55,83.77 | C1UC1.1 C3UC1.1 | VR11.OUT 55.23,106 52.06,109.17 39.99,109.17 38.72,110.44 38.72,113.62 37.45,114.89 32.37,114.89 29.2,118.06 29.2,128.22 27.93,129.49 25.39,129.49 24.12,128.22 24.12,118.06 20.31,114.25 17.77,114.25 16.03,112.51 R1JS1.2 14.27,112.03 12.69,110.44 12.69,97.11 9.51,93.93 9.51,79.33 12.18,76.66 C1JS1.1 | VR11.OUT 55.23,101.55 53.18,99.5 P1JS1.+ 31.12,98.39 31.1,98.38 31.74,97.74 JS1.H1 | 187.44,76.79 JS2.H1 | C1JS2.1 187.44,76.79 | JS2.V3 189.22,75.01 187.44,76.79 | ISP1UC1.2 v142.54,85.99 | C2UC2.1 C3UC2.1 88.76,114.89 87.62,114.89 86.66,113.93 UC2.7 79.36,113.93 75.55,110.12 v75.55,109.52 | v169.53,52.34 172.07,49.8 R1JS2.2 | D2SW2.2 143.03,60.45 v141.27,58.69 138.42,55.83 125.4,55.83 124.13,54.56 124.13,49.63 R1SW2.1 | JS1.V3 43.8,73.61 v43.8,74.25 | R1SW1.1 86.35,49.48 86.35,49.52 v88.89,52.06 | v73.33,59.96 67.93,65.36 53.96,65.36 52.06,63.45 52.06,62.04 D2SW1.2 | 75.55,83.77 ISP1UC2.2 | 75.55,83.77 75.55,95.2 67.93,102.82 VR11.OUT | R1L.2 109.05,126.47 v113.65,121.87
  pour Top (isolate 0.61, rank 6): -0.65,-0.68 210.17,-0.68 210.17,143.46 -0.65,143.46
CE_NRF
  Bottom 0.406: B1.CE 106.6,78.76 107.3,78.06 112.38,78.06 116.19,74.25 116.19,72.34 121.27,67.26 UC1.15
CSN_NRF
  Bottom 0.406: B1.CSN 105.33,77.81 106.03,77.1 111.43,77.1 114.92,73.61 114.92,71.07 118.73,67.26 UC1.16
GND  (via drill 1)
  Top 0.406: 43.8,135.69 R4P.1
  Top 0.457: 46.66,126.95 D1P.6 46.66,131.08 48.25,132.67 v50.15,132.67 | 46.66,126.95 D1P.3 | D1P.2 45.39,126.95 | 45.39,126.95 D1P.7 45.39,132.03 43.8,133.62 43.8,135.69 | 45.39,126.95 46.66,126.95
  Top 0.61: C6P.2 C5P.2 157.24,117.7 VR2.1 | VR12.1 52.69,114.1 52.69,113.62 52.56,113.49 C2P.2 C4P.2 C3P.2 52.69,106.5 VR11.GND
  Top 0.711: v26.66,127.59 25.7,128.54 Q1P.2 | VR12.1 49.63,114.33 C1P.2 v49.52,111.71 | v85.08,74.25 85.08,77.42 83.81,78.69 v73.65,78.69 | v74.28,107.27 61.58,107.27 59.68,105.36 59.68,100.92 58.41,99.65 53.96,99.65 52.69,100.92 VR11.GND | v201.92,50.12 168.26,50.12 161.36,57.02 v145.08,57.02 | v76.29,137.03 77.46,135.86 FTDI1UC2.GND | C6P.2 160.01,120.6 161.91,122.51 v180.33,122.51 180.33,128.86 179.06,130.13 149.85,130.13 FTDI1UC1.GND | v95.87,70.44 101.59,76.15 v124.76,76.15 | v37.45,97.11 35.44,99.11 B2JS1.4 | LED5UC1.C 97.93,47.09 v97.14,46.31 | LED7UC1.C v109.21,49.48
  Bottom 0.406: C2X2.2 80.18,103.46
  Bottom 0.457: C1SW1.2 55.85,60.15 D2SW1.1 | 145.38,60.15 D2SW2.1
  Bottom 0.61: 105.65,54.18 C1X1.2 | 113.65,53.8 C2X1.2 | C1M.2 171.31,122.38 H1M.2 174.48,122.51 C2M.2 C3M.2 | C6N.- 125.25,79.67 C5N.2 C4N.2 C3N.2 C2N.2 C1N.2 112.81,79.63 B1.GND
  Bottom 0.711: 80.18,103.46 78.73,103.46 78.09,104.09 78.09,107.27 | 78.09,107.27 78.09,110.44 78.86,111.21 C1X2.2 81.45,112.35 83.17,112.35 84.12,111.39 UC2.8 88.06,111.39 C3UC2.2 C2UC2.2 91.93,112.53 93.33,113.93 UC2.22 96.51,113.93 100.82,109.62 111.11,109.62 | UC1.22 103.49,69.67 C4UC1.2 101.08,69.8 C2UC1.2 96.64,69.67 v95.87,70.44 95.24,71.07 95.24,75.52 92.06,78.69 v73.65,78.69 ISP1UC2.6 69.84,78.06 68.25,76.47 63.17,76.47 61.58,78.06 48.25,78.06 37.45,88.85 v37.45,97.11 | UC1.8 106.03,57.74 105.4,57.1 105.4,54.43 105.65,54.18 105.58,54.11 C1UC1.2 C3UC1.2 100.95,52.18 | C1X1.2 105.9,52.79 106.67,52.02 113.02,52.02 | 113.02,52.02 113.65,52.66 113.65,53.8 | VR11.GND 52.69,105.68 51.37,107 B2JS1.4 | B2JS1.4 30.73,111.71 27.93,111.71 26.66,112.98 v26.66,127.59 | B2JS1.4 34.64,107 28.56,100.92 21.45,100.92 C4JS1.2 21.13,101.1 11.42,91.39 11.42,84.41 13.45,82.37 C3JS1.2 15.23,80.73 | 15.23,80.73 C1JS1.2 | JS1.H3 22.72,80.73 18.4,80.73 | 18.4,80.73 15.23,80.73 | JS1.B2A 32.37,60.91 35.55,64.09 JS1.V1 41.77,64.09 C2JS1.2 48.75,57.1 | 192.39,64.09 JS2.V1 | 192.39,64.09 196.07,64.09 C2JS2.2 | C2JS2.2 196.2,62.82 196.84,62.18 C4JS2.2 | 113.02,52.02 111.27,50.27 LED6UC1.C v109.21,49.48 103.65,49.48 100.95,52.18 | 118.25,125.68 Q2L.2 | 118.25,125.68 R3L.1 | 111.11,109.62 111.11,115.52 113.97,118.38 | C1UC2.2 111.11,109.62 | 174.61,100.28 172.58,98.25 C3JS2.2 172.71,95.07 172.71,92.03 | 145.38,60.15 C1SW2.2 147.94,57.1 | SW2.3 135.77,50.65 137.15,52.02 146.67,52.02 147.94,53.29 147.94,57.1 | 58.41,57.1 48.75,57.1 | 58.41,57.1 67,57.1 SW1.3 73.65,50.24 73.65,48.21 74.28,47.58 75.55,47.58 76.82,46.31 v97.14,46.31 98.26,47.42 LED4UC1.C 100.95,52.18
  Bottom 0.711: C1SW1.2 58.41,57.1 | ISP1UC1.6 142.54,76.47 141.59,75.52 135.24,75.52 | 135.24,75.52 131.43,75.52 129.53,77.42 C6N.- | 48.75,57.1 37.15,45.5 P1JS1.- 31.1,45.48 31.1,44.4 29.2,42.5 24.12,42.5 18.4,48.21 18.4,80.73 | JS2.B2A 184.14,57.1 190.49,57.1 192.39,59.01 192.39,64.09 | B1UC1.2 v85.08,74.25 | C2JS2.2 196.33,64.09 197.47,64.09 200.01,66.63 | 200.01,66.63 200.01,85.68 196.84,88.85 | v49.52,111.71 52.06,114.25 52.06,130.76 v50.15,132.67 50.15,137.11 51.42,138.38 62.85,138.38 64.12,137.11 76.2,137.11 v76.29,137.03 | 78.09,107.27 v74.28,107.27 | 135.24,75.52 135.24,87.58 139.69,92.03 172.71,92.03 | 147.94,57.1 145.17,57.1 v145.08,57.02 | v201.92,50.12 201.92,64.72 200.01,66.63 | 113.97,118.38 118.25,122.66 118.25,125.68 | 113.97,118.38 99.68,132.67 H2L.5 | C3M.2 180.2,122.38 v180.33,122.51 | JS2.H3 172.71,80.6 172.71,92.03 | 174.61,100.28 185.41,100.28 196.84,88.85 | C1JS2.2 196.71,88.85 196.84,88.85 | 172.71,109.81 H1M.7 174.61,109.81 | 174.61,109.81 174.61,100.28 | 174.61,109.81 C2M.2
  other vias: 127.62,76.15
  pour Top (isolate 0.61): 156.83,121.87 161.28,121.87 161.28,114.25 156.83,114.25
  pour Bottom (isolate 0.61): 109.52,81.23 130.8,81.23 130.8,74.88 122.54,74.88 122.54,79.33 108.89,79.33 108.89,80.6
  pour Bottom (isolate 0.61, rank 6): -1.28,-1.32 210.81,-1.32 210.81,144.1 -1.28,144.1
LCD_CS
  Bottom 0.457: H1L.4 85.08,133.94 92.06,126.95 92.06,126 UC2.26
LCD_D0
  Bottom 0.406: UC2.14 91.43,96.15 93.33,94.25 97.46,94.25 101.9,89.8 H4L.8
LCD_D1
  Bottom 0.406: UC2.15 98.09,96.15 104.44,89.8 H4L.7
LCD_D2
  Bottom 0.457: H3L.6 84.44,86.95 84.44,85.68 83.81,85.04 79.36,85.04 78.09,86.31 78.09,95.84 68.57,105.36 68.57,109.17 80.95,121.55 UC2.4
LCD_D3
  Bottom 0.406: H3L.5 86.98,88.22 86.98,88.85 85.71,90.12 82.54,90.12
  Bottom 0.457: UC2.5 80.31,119.01 70.47,109.17 70.47,105.36 79.36,96.47 79.36,93.3 82.54,90.12
LCD_D4
  Bottom 0.406: H3L.4 89.52,88.22 89.52,88.85 87.3,91.07 83.17,91.07
  Bottom 0.457: UC2.6 80,116.47 72.38,108.85 72.38,105.36 80.63,97.11 80.63,93.61 83.17,91.07
LCD_D5
  Bottom 0.406: UC2.11 86.03,103.77 81.9,99.65 81.9,94.25 84.12,92.03 89.52,92.03 92.06,89.49 92.06,88.22 H3L.3
LCD_D6
  Bottom 0.406: UC2.12 85.39,101.23 83.17,99.01 83.17,94.57 84.76,92.98 91.11,92.98 94.6,89.49 94.6,88.22 H3L.2
LCD_D7
  Bottom 0.406: UC2.13 85.39,98.69 84.44,97.74 84.44,95.2 85.39,94.25 91.74,94.25 93.01,92.98 93.65,92.98 97.14,89.49 97.14,88.22 H3L.1
LCD_PWR  (via drill 1)
  Top 0.457: v116.19,131.4 84.44,131.4 82.54,129.49 82.54,115.52 78.41,111.39 78.41,105.68 62.22,89.49 62.22,76.15 74.28,64.09 77.14,64.09 79.68,66.63 v79.68,67.26
  Bottom 0.406: R2L.1 R3L.2
  Bottom 0.457: v116.19,131.4 122.54,131.4 123.18,130.76 123.18,129.64 R2L.1 | v79.68,67.26 79.68,66.63 83.17,63.13 97.78,63.13 98.41,62.5 UC1.5
LCD_RD
  Bottom 0.457: UC2.23 100,116.47 100.95,115.52 102.22,115.52 104.13,117.43 104.13,125.07 93.99,135.21 H1L.1
LCD_RS
  Bottom 0.406: 94.28,121.55 UC2.25
  Bottom 0.457: H1L.3 87.62,133.3 89.84,131.08 94.71,131.08 101.59,124.2 101.59,122.19 100.95,121.55 UC2.25
LCD_WR
  Bottom 0.457: H1L.2 90.16,133.94 91.74,132.35 95.24,132.35 102.86,124.73 102.86,121.55 100.95,119.65 98.73,119.65 98.09,119.01 UC2.24
LEFT_BUTTON  (via drill 1)
  Top 0.457: v45.71,65.04 41.26,69.48 41.26,74.25 33.64,81.87 33.64,93.3 31.74,95.2 19.67,95.2 18.4,96.47 v18.4,102.5
  Bottom 0.406: R2JS1.1 17.22,106.48 D1JS1.C
  Bottom 0.457: C4JS1.1 19.04,106.13 R2JS1.1 | v18.4,102.5 15.86,105.04 D1JS1.C | v45.71,65.04 49.2,68.53 75.87,68.53 82.54,61.86 94.92,61.86 95.87,60.91 UC1.4
MENU
  Bottom 0.457: D1SW2.C 152.48,63.7 R3SW2.2 147.96,62.97 C1SW2.1 144.43,62.95 D2SW2.3 142.06,62.65 137.15,57.74 120,57.74 118.73,59.01 UC1.13
MISO1
  Bottom 0.406: B1.MISO 101.51,75.91 102.22,75.2 109.52,75.2 112.38,72.34 112.38,68.53 113.65,67.26 UC1.18 | 115.87,64.4 124.79,64.4
  Bottom 0.457: UC1.18 113.65,66.63 115.87,64.4 | 124.79,64.4 132.39,72.01 143.17,72.01 146.04,74.88 146.04,81.23 144.77,82.5 144.77,86.95 143.5,88.22 141.27,88.22 140,86.95 ISP1UC1.1
MODE
  Bottom 0.457: D2SW1.3 54.9,62.95 C1SW1.1 61.56,62.95 R3SW1.2 62.31,63.7 D1SW1.C 67.05,63.7 72.69,58.05 80,58.05 81.9,56.15 85.39,56.15 87.3,54.24 92.38,54.24 95.81,57.68 99.05,57.68 99.77,58.4 UC1.6
MOSI1
  Bottom 0.406: B1.MOSI 102.78,76.86 103.49,76.15 110.48,76.15 113.65,72.98 113.65,69.8 116.19,67.26 UC1.17 | 123.81,65.36 117.46,65.36
  Bottom 0.457: 123.81,65.36 132.07,73.61 142.54,73.61 144.45,75.52 144.45,80.28 143.5,81.23 ISP1UC1.4 | 117.46,65.36 116.19,66.63 UC1.17
N$1
  pour Bottom (isolate 0.61, rank 6): 88.25,116.79 92.06,116.79 92.06,124.41 88.25,128.22
N$2
  cutout Top: 129.53,51.7 130.16,47.26 119.37,45.35 118.73,49.8
N$3
  Bottom 0.457: UC1.21 106.03,69.67 C4UC1.1
N$4
  cutout Top: 80,51.7 79.36,47.26 88.57,45.67 89.52,50.12
N$5
  Top 0.457: LED1SW1.A 78.15,53.29 R2SW1.1
N$6
  cutout Top: 157.78,99.65 arc-90 159.37,101.23 180.96,101.23 arc-90 182.55,99.65 182.55,97.11 arc-90 180.96,95.52 159.37,95.52 arc-90 157.78,97.11
N$7
  Top 0.457: FTDI1UC1.DTR C5UC1.1
N$8
  Top 0.711: 42.88,28.38 44.73,34.02 45.98,39.74 47.44,46.44 47.5,46.77 47.7,47.37 48.01,47.94 48.41,48.46 48.88,48.9 49.42,49.26 50.01,49.52 50.63,49.69 51.28,49.75 51.91,49.71 52.24,49.64 arc11 96.82,43.77 101.59,43.77 101.59,44.4 arc-90 104.76,47.58 arc-90 107.94,44.4 107.94,43.77 109.52,43.77 119.05,44.08 129.21,45.04 137.78,45.99 142.86,46.94 157.28,49.64 157.61,49.71 158.24,49.75 158.89,49.69 159.51,49.52 160.1,49.26 160.64,48.9 161.12,48.46 161.51,47.94 161.82,47.37 162.02,46.77 162.08,46.44 164.79,34.02 168.09,23.99 169.53,20.59 BATT2.+ | 42.88,28.38 | 42.88,28.38 40.76,21.95 40.29,20.88 BATT1.-
N$9
  Bottom 0.457: SW2.1 131.79,49.76 130.8,50.75 128.09,50.75 R1SW2.2
N$10  (via drill 1)
  Top 0.457: 131.21,53 LED1SW2.C 127.01,53.27 v126.35,53.93
  Bottom 0.457: D1SW2.A 152.48,59.4 R3SW2.1 151.75,55.2 147.31,50.75 139.69,50.75 137.46,48.53 134.61,48.53 133.8,49.34 SW2.2 133.8,53.46 133.02,54.24 126.67,54.24 v126.35,53.93
N$11
  Top 0.457: R4P.2 LED1P.C
N$12  (via drill 1)
  Top 0.457: LED1SW1.C 73.02,55.51 v72.06,55.51
  Bottom 0.457: R3SW1.1 62.31,59.4 D1SW1.A 68.18,59.4 v72.06,55.51 75.73,51.84 SW1.2
N$13
  Top 0.457: LED1SW2.A 134.12,54.63 R2SW2.1
N$14
  Bottom 0.457: SW1.1 78.73,50.75 81.11,50.75 R1SW1.2
N$15
  Bottom 0.457: R2JS2.2 200.1,34.72 D1JS2.A 184.86,34 173.26,45.59 | 173.26,45.59 R1JS2.1 | JS2.B1A 182.18,54.51 173.26,45.59
N$16  (via drill 1)
  Top 0.711: BATT2.- 201.9,92.03 | 201.9,92.03 | 201.9,92.03 198.61,120.81 | 198.61,120.81 | 198.61,120.81 198.57,121.14 197.84,124.55 197.21,126.22 196.62,127.62 195.25,129.94 192.49,133.1 191.65,133.81 190.53,134.75 190.3,134.89 | 190.3,134.89 | 190.3,134.89 187.73,136.41 185.81,137.14 184.67,137.57 181.75,138.15 181.46,138.21 181.17,138.25 181.15,138.27 178.88,138.67 | 178.88,138.67 | 178.88,138.67 177.29,138.95 173.11,139.37 172.67,139.38 168.79,139.47 168.57,139.47 164.71,139.56 104.76,140.74 40.96,139.48 40.95,139.47 40.63,139.47 40.5,139.47 38.73,139.43 | 38.73,139.43 | 38.73,139.43 36.41,139.37 33.07,139.04 31.05,138.72 29.19,138.4 | 29.19,138.4 28.35,138.25 28.06,138.21 27.77,138.15 27.76,138.15 24.82,137.57 Q1P.3 30.48,131.86 R2P.1 | v29.2,136.48 29.2,138.39 29.19,138.4
  Bottom 0.711: SW1P.3 31.36,136.48 v29.2,136.48
N$17
  Bottom 0.457: LED4UC1.A 94.6,49.33 R16UC1.1
N$18
  Bottom 0.457: LED6UC1.A 114.92,49.33 R18UC1.1
N$19
  Top 0.457: C4UC2.1 FTDI1UC2.DTR
N$20
  Top 0.457: LED5UC1.A 92.85,49.48 R17UC1.1
N$21
  Bottom 0.457: Q1L.3 105.67,132.4 104.76,133.3 H2L.3
N$22
  Top 0.457: LED7UC1.A 116.67,49.48 R19UC1.1
N$23
  Top 0.457: LED1P.A 53.96,135.69 53.96,123.14
  Top 0.711: Q2P.3 23.12,119.7 25.39,117.43 46.34,117.43 | VR11.IN 46.34,106.63 46.34,117.43 | 46.34,117.43 52.06,123.14 53.96,123.14 57.77,123.14 59.04,121.87 59.04,115.83 VR12.3 | C1P.1 49.33,117.43 46.34,117.43
N$24  (via drill 1)
  Top 0.457: D1P.8 44.12,131.4 40.94,134.57 v40.94,136.48
  Bottom 0.457: SW1P.2 34.72,136.92 35.55,137.75 39.99,137.75 40.94,136.79 v40.94,136.48
N$25  (via drill 1)
  Top 0.711: R1P.1 35.7,126.95 R2P.2 35.7,130.91 v36.82,132.03
  Bottom 0.711: v36.82,132.03 36.82,135.02 SW1P.1
N$26
  Bottom 0.406: Q1L.1 111.43,128.06 R1L.1 Q2L.3
N$31
  Top 0.457: R3P.1 31.27,119.97 42.53,119.97 44.12,121.55 D1P.1
  Top 0.711: R3P.1 28.41,122.83 Q2P.1
N$32
  Bottom 0.406: Q2L.1 118.25,129.49 R2L.2
PITCH
  Bottom 0.406: 100.32,61.55 135.24,61.55
  Bottom 0.457: C2JS2.1 196.07,66.63 JS2.V2 140.32,66.63 135.24,61.55 | UC1.24 98.41,64.72 99.68,63.45 99.68,62.18 100.32,61.55
RESET  (via drill 1)
  Top 0.457: C4UC2.2 64.89,129.81 v72.69,129.81 77.14,125.36 77.14,106.31 71.11,100.28 v64.12,100.28 | 71.74,69.8 v74.92,66.63 | 71.74,69.8 64.76,76.79 v64.76,78.69 | v137.46,78.69 137.46,72.66 127.62,62.82 90.79,62.82 88.25,60.28 88.25,58.37 88.89,57.74 90.16,57.74 90.79,57.1 90.79,55.51 89.52,54.24 87.3,54.24 86.35,55.2 86.03,55.2 84.76,56.47 81.9,56.47 80.63,57.74 80.63,64.72 82.54,66.63 82.54,69.17 81.9,69.8 71.74,69.8 | v124.45,135.21 C5UC1.2
  Bottom 0.406: UC2.1 83.49,129.17 82.54,130.13 H1L.5 | B1UC1.1 85.48,59.58
  Bottom 0.457: 82.54,130.13 73.01,130.13 v72.69,129.81 | ISP1UC2.5 v64.76,78.69 64.12,79.33 v64.12,100.28 | ISP1UC1.5 v137.46,78.69 | H1L.5 82.54,137.11 84.44,139.02 120.64,139.02 v124.45,135.21 | UC1.1 87.84,59.98 B1UC1.1 81.71,59.98 R1UC1.1 81.27,60.28 v74.92,66.63
RIGHT_BUTTON
  Bottom 0.457: C4JS2.1 199.38,55.7 D1JS2.C 200.1,37.57 R2JS2.1 202.72,37.73 204.46,37.73 206.36,35.83 206.36,33.61 204.46,31.7 181.6,31.7 166.36,46.94 166.36,58.37 159.37,65.36 141.59,65.36 135.81,59.58 UC1.14
ROLL
  Bottom 0.406: 134.29,62.5 101.59,62.5
  Bottom 0.457: 134.29,62.5 139.69,67.9 186.04,67.9 187.31,69.17 187.31,69.8 182.23,74.88 180.96,74.88 JS2.H2 179.06,78.06 177.79,79.33 177.79,92.79 C3JS2.1 | 101.59,62.5 100.95,63.13 UC1.23
SCK1
  Bottom 0.406: B1.SCK 104.06,80.53 104.76,81.23 104.76,82.5 104.13,83.14 99.68,83.14 99.05,82.5 99.05,78.69 100.32,77.42 100.32,75.52 101.59,74.25 108.57,74.25 111.11,71.71 UC1.19 | 114.29,63.45 125.76,63.45
  Bottom 0.457: UC1.19 111.11,66.63 114.29,63.45 | 125.76,63.45 132.72,70.41 144.13,70.41 147.62,73.9 147.62,82.18 146.35,83.45 146.35,87.58 144.13,89.8 140.64,89.8 138.42,87.58 138.42,85.04 137.78,84.41 137.78,82.5 139.05,81.23 ISP1UC1.3
SCL  (via drill 1)
  Top 0.457: v135.88,126.63 v96.51,126.63 96.51,113.62 107.94,102.19 107.94,93.3 106.03,91.39 100.95,91.39 99.36,89.8 99.36,85.99 98.41,85.04 89.52,85.04 88.25,83.77 v88.25,74.25
  Bottom 0.457: UC1.28 v88.25,74.25 | UC2.28 v96.51,126.63 | v135.88,126.63 159.69,126.63 166.36,119.97 H1M.3
SD_DI  (via drill 1)
  Top 0.457: v103.49,95.84 97.78,90.12 75.55,90.12 73.65,88.22 v73.65,81.23
  Bottom 0.406: UC2.17 98.09,101.23 v103.49,95.84 109.52,89.8 H4L.5
  Bottom 0.457: ISP1UC2.4 v73.65,81.23
SD_DO  (via drill 1)
  Top 0.457: v71.11,92.03 96.51,92.03 v103.17,98.69
  Bottom 0.406: UC2.18 98.09,103.77 v103.17,98.69 112.06,89.8 H4L.4
  Bottom 0.457: ISP1UC2.1 67.3,91.39 67.93,92.03 v71.11,92.03
SD_SCK  (via drill 1)
  Top 0.457: v73.01,93.93 95.24,93.93 v102.86,101.55
  Bottom 0.406: UC2.19 98.09,106.31 v102.86,101.55 114.6,89.8 H4L.3
  Bottom 0.457: ISP1UC2.3 65.39,83.14 65.39,92.03 67.3,93.93 v73.01,93.93
SD_SS
  Bottom 0.406: UC2.16 98.09,98.69 106.98,89.8 H4L.6
SDA  (via drill 1)
  Top 0.457: v91.43,74.25 91.43,82.5 92.06,83.14 97.78,83.14 98.77,84.13 98.79,84.13 100.32,85.65 100.32,89.17 101.27,90.12 106.67,90.12 109.21,92.66 109.21,122.82 108.57,123.46 | 108.57,123.46 v99.68,123.46 | 108.57,123.46 109.21,124.09 v131.11,124.09
  Bottom 0.457: v131.11,124.09 159.05,124.09 165.72,117.43 H1M.4 | UC1.27 90.79,73.61 v91.43,74.25 | v99.68,123.46 97.14,123.46 UC2.27
SIGNAL_LED  (via drill 1)
  Top 0.457: v118.73,54.24 116.83,52.34 R19UC1.2
  Bottom 0.457: UC1.12 116.19,59.01 118.73,56.47 v118.73,54.24 117.46,52.97 R18UC1.2
SN1  (via drill 1)
  Top 0.457: v37.45,52.02 16.5,52.02 13.96,54.56 13.96,80.6 16.5,83.14 22.21,83.14 26.66,87.58 31.1,87.58 32.37,88.85 32.37,92.66 31.1,93.93 17.13,93.93 15.23,95.84 15.23,110.12 17.13,112.03 22.9,112.03 B2JS1.1
  Bottom 0.406: B2JS1.1 22.9,112.03 R1JS1.1 19.04,111.86 R2JS1.2 18.94,109.42 D1JS1.A
  Bottom 0.711: JS1.B1A 34.97,54.51 v37.45,52.02
THROTTLE
  Bottom 0.457: P1JS1.MIDDLE 27.12,51.85 29.2,53.93 29.2,60.91 34.91,66.63 JS1.V2 39.49,66.76 C2JS1.1 44.94,69.8 76.82,69.8 77.46,69.17 80.63,69.17 81.9,67.9 81.9,66.31 83.81,64.4 94.92,64.4 95.87,65.36 UC1.25
  Bottom 0.711: C2JS1.1 41.77,66.63
URX1  (via drill 1)
  Top 0.457: v83.17,58.05 83.17,60.28 83.81,60.91 83.81,67.9 87.62,71.71 92.38,71.71 100.63,79.96 130.16,79.96 132.07,81.87 132.07,103.46 133.34,104.73 180.33,104.73 182.23,106.63 182.23,129.49 179.69,132.03 151.12,132.03 146.04,137.11 138.42,137.11 137.15,135.84 FTDI1UC1.TXO
  Bottom 0.457: UC1.2 90.79,58.37 90.16,57.74 83.81,57.74 83.49,58.05 v83.17,58.05
URX2  (via drill 1)
  Top 0.457: FTDI1UC2.TXO v69.84,132.67
  Bottom 0.457: v69.84,132.67 69.84,128.22 71.74,126.32 86.03,126.32 UC2.2
UTX1  (via drill 1)
  Top 0.457: FTDI1UC1.RXI 134.61,136.48 136.51,138.38 146.67,138.38 151.75,133.3 180.33,133.3 183.5,130.13 183.5,106 180.96,103.46 133.97,103.46 133.34,102.82 133.34,81.23 130.8,78.69 101.27,78.69 93.01,70.44 88.25,70.44 85.71,67.9 85.71,57.1 86.66,56.15 v88.57,56.15
  Bottom 0.457: UC1.3 93.33,57.74 91.74,56.15 v88.57,56.15
UTX2  (via drill 1)
  Top 0.457: FTDI1UC2.RXI v67.3,132.67
  Bottom 0.457: v67.3,132.67 67.3,132.03 68.25,131.08 68.25,127.27 70.79,124.73 85.39,124.73 86.03,124.09 UC2.3
VCC
  Top 0.711: BATT1.+ 16.52,92 13.32,95.2 13.32,119.18 Q1P.1 23.8,126.98 25.59,125.2 | 25.59,125.2 R3P.2 29.03,125.05 31.74,125.05 34.11,122.67 R1P.2 | 25.59,125.2 Q2P.2
WARNING_LED  (via drill 1)
  Top 0.457: v116.83,55.83 114.92,57.74 104.76,57.74 98.73,51.7 v96.51,51.7 | 96.04,52.17 v96.51,51.7 | v96.51,51.7 96.04,52.17 | 96.04,52.17 R17UC1.2
  Bottom 0.457: UC1.11 113.65,59.01 v116.83,55.83 | v96.51,51.7 96.04,52.17 R16UC1.2
XTAL11
  Bottom 0.406: UC1.9 108.57,56.97 XTAL1UC1.1 108.7,54.56 C1X1.1
XTAL12
  Bottom 0.406: C2X1.1 110.98,54.56 XTAL1UC1.2 111.11,56.97 UC1.10
XTAL21
  Bottom 0.406: UC2.9 83.36,108.85 XTAL1UC2.1 81.26,108.41 C1X2.1
XTAL22
  Bottom 0.406: C2X2.1 81.26,106.13 XTAL1UC2.2 84,106.31 UC2.10
YAW
  Bottom 0.457: C3JS1.1 21.45,85.17 29.2,77.42 JS1.H2 29.2,75.52 30.47,74.25 33.01,74.25 34.91,76.15 60.95,76.15 62.22,74.88 69.2,74.88 70.47,76.15 92.06,76.15 93.33,74.88 UC1.26

### Text on the board
Top: Vasil Kalchev | MaD-R-2 | r1.0.0 | rev. A | GND | GND | Acro | Menu | Stab | Flight
Bottom: RX | TX | VCC | RX | TX | VCC | GND | LCD uC | Main uC | + | - | Li-ion 18650 | Li-ion 18650 | - | +
tStop: 3.3V | Vasil Kalchev | MaD-R-2 | 5V | r1.0.0 | Acro | Menu | Stab | Flight
bStop: GND